# Altium schematic sheet Var7.SchDoc
size A4; SheetNumber: 10; SheetTotal: 12
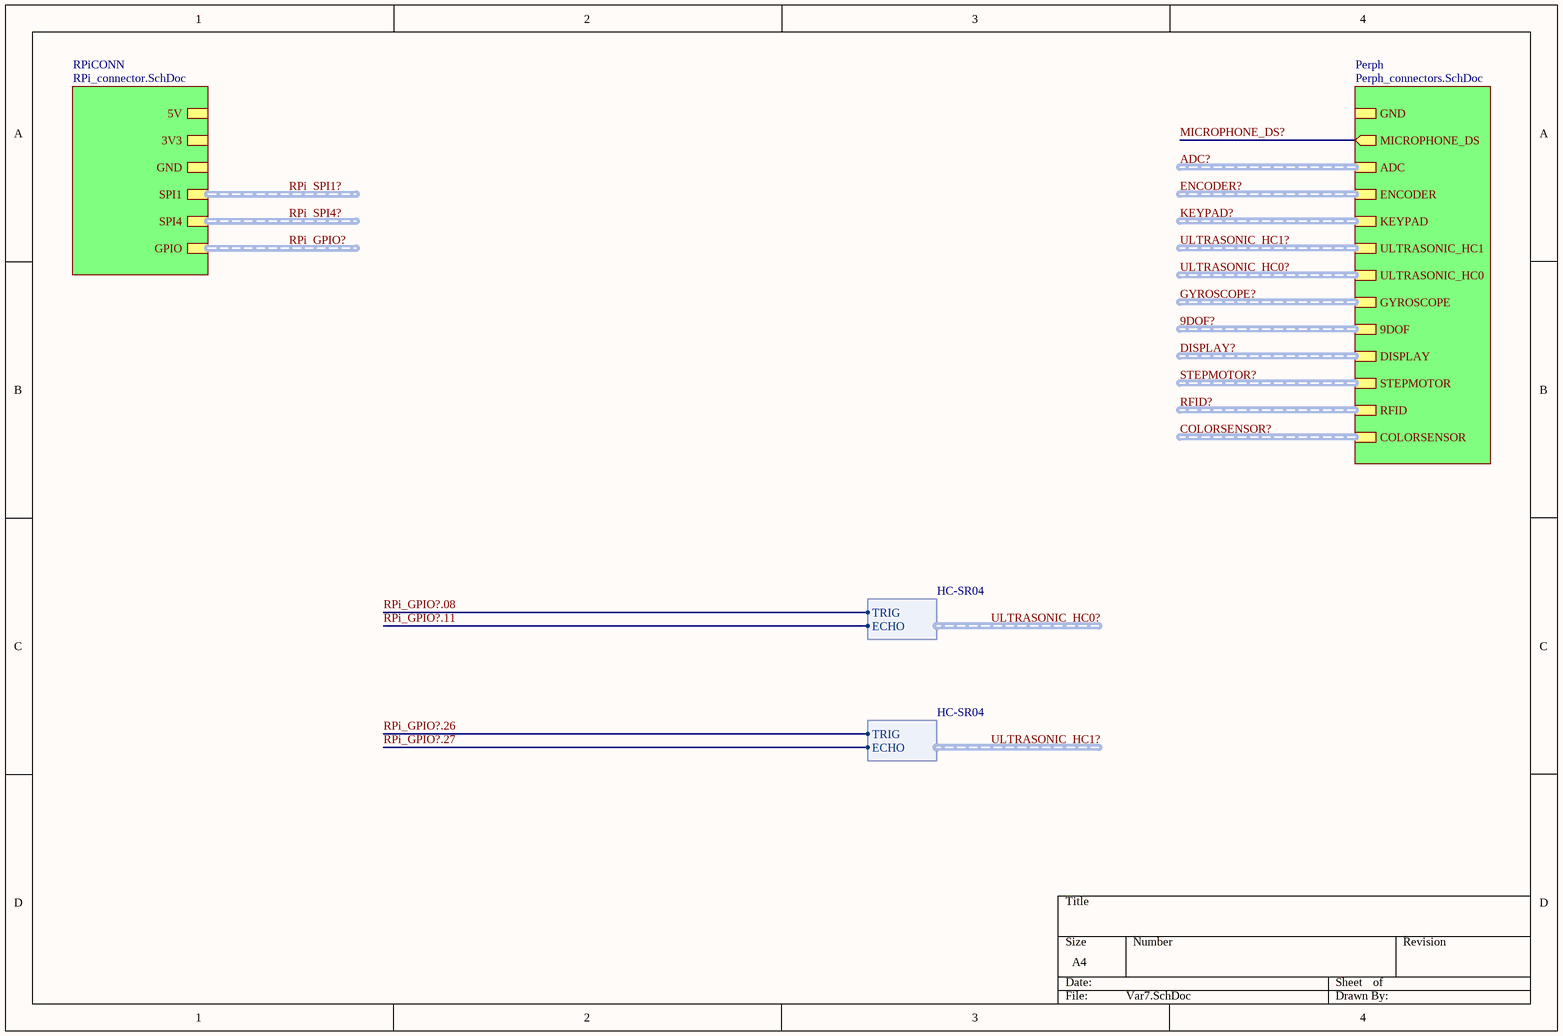
[diagram p0: Var7.SchDoc]

## Sub-sheets
Perph = Perph_connectors.SchDoc: MICROPHONE_DS (out), ADC (harness ADS1115 module), GYROSCOPE (harness GY-50 L3GD20 Gyro), ULTRASONIC_HC1 (harness HC-SR04), GND, KEYPAD (harness Keypad COM-08653), ULTRASONIC_HC0 (harness HC-SR04), DISPLAY (harness MSP3520), STEPMOTOR (harness ULN2003 Module), RFID (harness RC522), ENCODER (harness KY-040), COLORSENSOR (harness TCS34725), 9DOF (harness 9DOF)
RPiCONN = RPi_connector.SchDoc: 5V, 3V3, GND, SPI4 (harness SPI_2CS), SPI1 (harness SPI_3CS), GPIO (harness RPI_GPIO)

## Harnesses
HC-SR04: ECHO, TRIG

## Nets
MICROPHONE_DS?: sheet Perph/MICROPHONE_DS
RPi_GPIO?.08: sheet Perph/ULTRASONIC_HC0.TRIG
RPi_GPIO?.11: sheet Perph/ULTRASONIC_HC0.ECHO
RPi_GPIO?.26: sheet Perph/ULTRASONIC_HC1.TRIG
RPi_GPIO?.27: sheet Perph/ULTRASONIC_HC1.ECHO

## Buses and harness runs
harness 9DOF? = sheet Perph/9DOF
harness ADC? = sheet Perph/ADC
harness COLORSENSOR? = sheet Perph/COLORSENSOR
harness DISPLAY? = sheet Perph/DISPLAY
harness ENCODER? = sheet Perph/ENCODER
harness GYROSCOPE? = sheet Perph/GYROSCOPE
harness KEYPAD? = sheet Perph/KEYPAD
harness RFID? = sheet Perph/RFID
harness RPi_GPIO? = sheet RPiCONN/GPIO
harness RPi_SPI1? = sheet RPiCONN/SPI1
harness RPi_SPI4? = sheet RPiCONN/SPI4
harness STEPMOTOR? = sheet Perph/STEPMOTOR
harness ULTRASONIC_HC0? = sheet Perph/ULTRASONIC_HC0
harness ULTRASONIC_HC1? = sheet Perph/ULTRASONIC_HC1